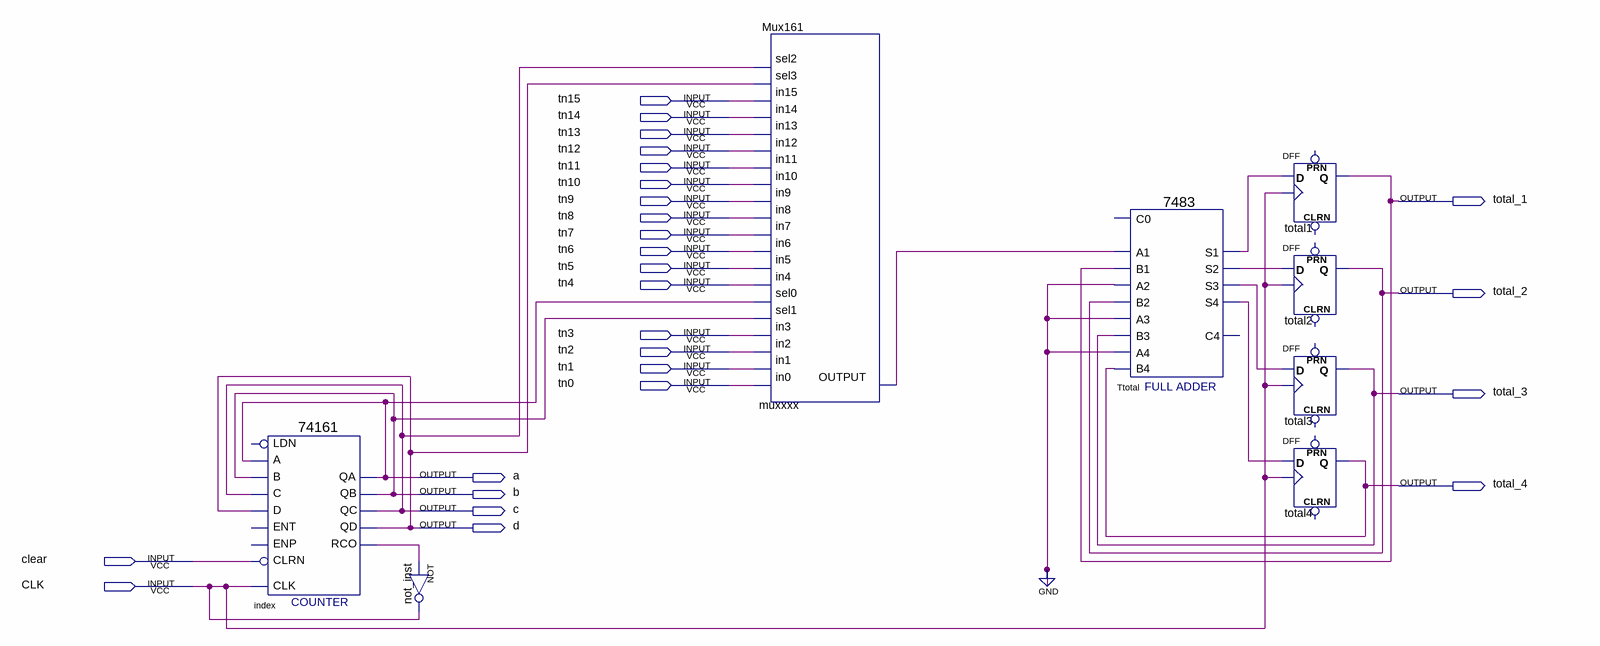
[diagram p0: schematic sheet]
// Quartus schematic FourBitCounter.bdf as structural Verilog: 8 symbols, 26 pins
module FourBitCounter (
  input  tn15,
  input  tn14,
  input  tn13,
  input  tn12,
  input  tn11,
  input  tn10,
  input  tn9,
  input  tn8,
  input  tn7,
  input  tn6,
  input  tn5,
  input  tn4,
  input  tn3,
  input  tn2,
  input  tn1,
  input  tn0,
  input  clear,
  input  CLK,
  output total_1,
  output total_2,
  output total_3,
  output a,
  output total_4,
  output b,
  output c,
  output d
);

  wire index_rco, Mux161_output, Ttotal_s1, Ttotal_s2, Ttotal_s3, Ttotal_s4;

  \74161  index (
    .CLRN(clear), .CLK(CLK), .A(a), .D(d), .B(b), .C(c), .QD(d), .QC(c), .QB(b), .QA(a), .RCO(index_rco));  // open: ENP, LDN, ENT
  not not_inst (CLK, index_rco);
  muxxxx Mux161 (
    .in0(tn0), .in1(tn1), .in2(tn2), .in3(tn3), .sel1(b), .sel0(a), .in4(tn4), .in5(tn5), .in6(tn6),
    .in7(tn7), .in8(tn8), .in9(tn9), .in10(tn10), .in11(tn11), .in12(tn12), .in13(tn13), .in14(tn14),
    .in15(tn15), .sel3(d), .sel2(c), .OUTPUT(Mux161_output));
  \7483  Ttotal (
    .B4(total_4), .A1(Mux161_output), .A2(1'b0), .B1(total_1), .B2(total_2), .A3(1'b0), .B3(total_3),
    .A4(1'b0), .S3(Ttotal_s3), .S4(Ttotal_s4), .S2(Ttotal_s2), .S1(Ttotal_s1));  // open: C0, C4
  DFF total1 (.CLK(CLK), .D(Ttotal_s1), .Q(total_1));  // open: CLRN, PRN
  DFF total2 (.CLK(CLK), .D(Ttotal_s2), .Q(total_2));  // open: CLRN, PRN
  DFF total3 (.CLK(CLK), .D(Ttotal_s3), .Q(total_3));  // open: CLRN, PRN
  DFF total4 (.CLK(CLK), .D(Ttotal_s4), .Q(total_4));  // open: CLRN, PRN
endmodule
